# Altium project LED ring V1.PrjPcb
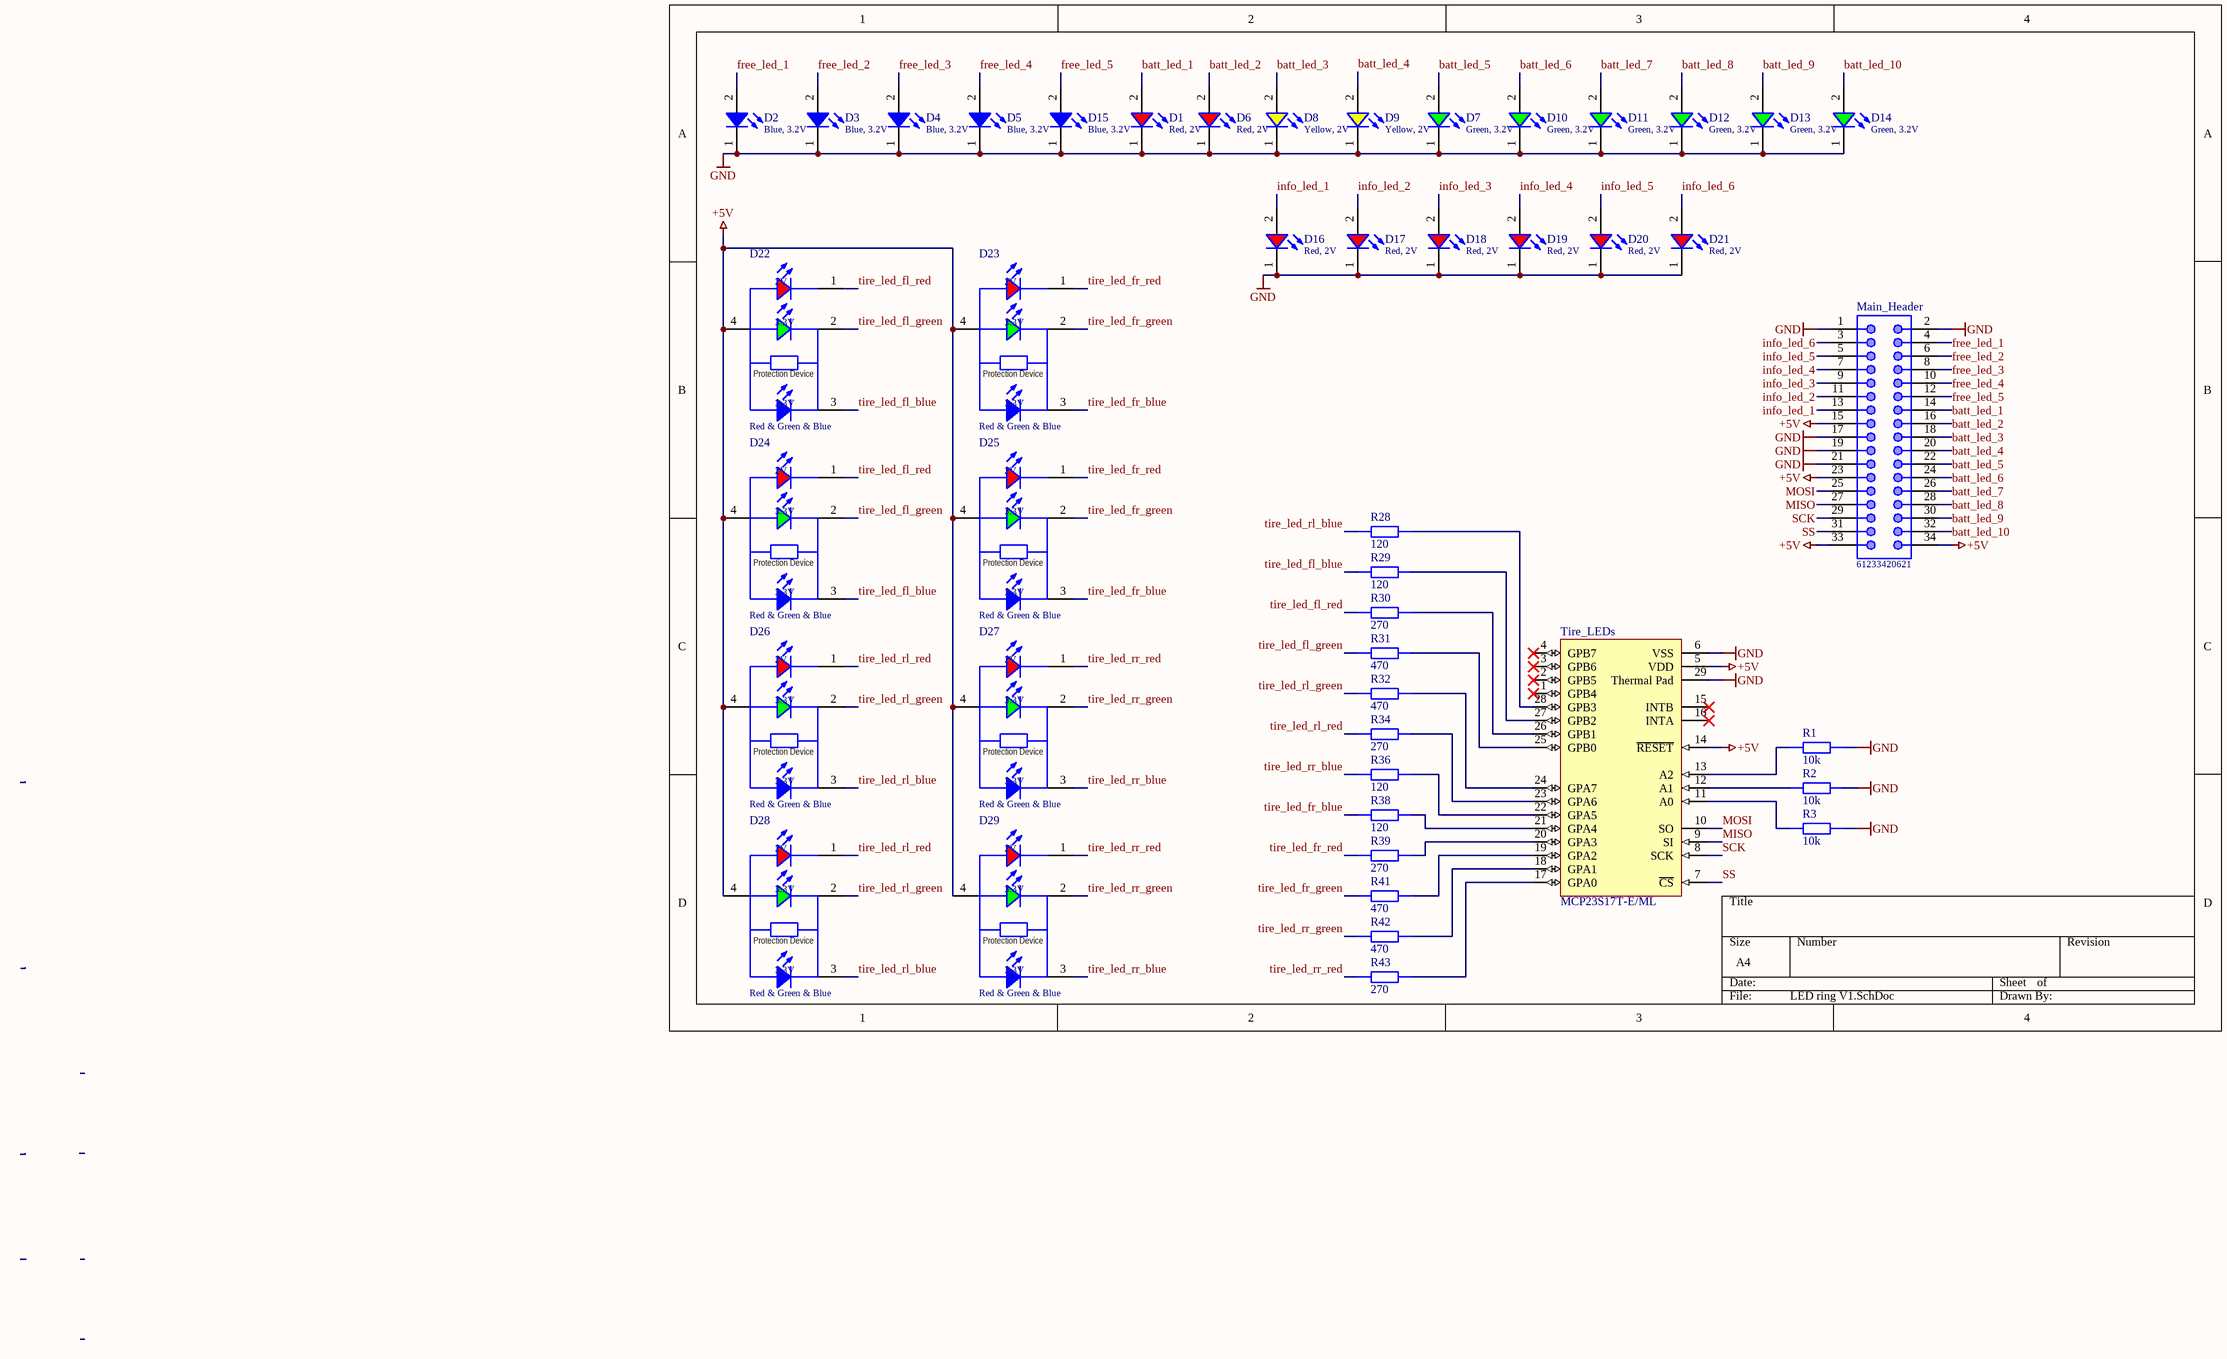
[diagram p0: LED ring V1.SchDoc]
1 sheet, 46 parts. Net scope: global (net labels, ports and power ports of the same name join across sheets).
Board file: LED ring V1.PcbDoc

## Sheet LED ring V1.SchDoc
size A4; SheetNumber: 1; SheetTotal: 1

### Parts
D1  Red, 2V  [WL-SMCW_0805]
D2  Blue, 3.2V  [WL-SMCW_0805]
D3  Blue, 3.2V  [WL-SMCW_0805]
D4  Blue, 3.2V  [WL-SMCW_0805]
D5  Blue, 3.2V  [WL-SMCW_0805]
D6  Red, 2V  [WL-SMCW_0805]
D7  Green, 3.2V  [WL-SMCW_0805]
D8  Yellow, 2V  [WL-SMCW_0805]
D9  Yellow, 2V  [WL-SMCW_0805]
D10  Green, 3.2V  [WL-SMCW_0805]
D11  Green, 3.2V  [WL-SMCW_0805]
D12  Green, 3.2V  [WL-SMCW_0805]
D13  Green, 3.2V  [WL-SMCW_0805]
D14  Green, 3.2V  [WL-SMCW_0805]
D15  Blue, 3.2V  [WL-SMCW_0805]
D16  Red, 2V  [WL-SMCW_0805]
D17  Red, 2V  [WL-SMCW_0805]
D18  Red, 2V  [WL-SMCW_0805]
D19  Red, 2V  [WL-SMCW_0805]
D20  Red, 2V  [WL-SMCW_0805]
D21  Red, 2V  [WL-SMCW_0805]
D22  Red & Green & Blue  [WL-SFCW_0805]
D23  Red & Green & Blue  [WL-SFCW_0805]
D24  Red & Green & Blue  [WL-SFCW_0805]
D25  Red & Green & Blue  [WL-SFCW_0805]
D26  Red & Green & Blue  [WL-SFCW_0805]
D27  Red & Green & Blue  [WL-SFCW_0805]
D28  Red & Green & Blue  [WL-SFCW_0805]
D29  Red & Green & Blue  [WL-SFCW_0805]
Main_Header  61233420621  [61233420621]
R1  value 10k  [STACKPOLE CSR0603]  (hidden comment: SMD Resistor)
R2  value 10k  [STACKPOLE CSR0603]  (hidden comment: SMD Resistor)
R3  value 10k  [STACKPOLE CSR0603]  (hidden comment: SMD Resistor)
R28  value 120  [STACKPOLE CSR0603]  (hidden comment: SMD Resistor)
R29  value 120  [STACKPOLE CSR0603]  (hidden comment: SMD Resistor)
R30  value 270  [STACKPOLE CSR0603]  (hidden comment: SMD Resistor)
R31  value 470  [STACKPOLE CSR0603]  (hidden comment: SMD Resistor)
R32  value 470  [STACKPOLE CSR0603]  (hidden comment: SMD Resistor)
R34  value 270  [STACKPOLE CSR0603]  (hidden comment: SMD Resistor)
R36  value 120  [STACKPOLE CSR0603]  (hidden comment: SMD Resistor)
R38  value 120  [STACKPOLE CSR0603]  (hidden comment: SMD Resistor)
R39  value 270  [STACKPOLE CSR0603]  (hidden comment: SMD Resistor)
R41  value 470  [STACKPOLE CSR0603]  (hidden comment: SMD Resistor)
R42  value 470  [STACKPOLE CSR0603]  (hidden comment: SMD Resistor)
R43  value 270  [STACKPOLE CSR0603]  (hidden comment: SMD Resistor)
Tire_LEDs  MCP23S17T-E/ML  [QFN-ML28_M]

### Nets
+5V: D22.4(A) D23.4(A) D24.4(A) D25.4(A) D26.4(A) D27.4(A) D28.4(A) D29.4(A) Main_Header.15 Main_Header.23 Main_Header.33 Main_Header.34 Tire_LEDs.5(VDD) Tire_LEDs.14(~{RESET})
GND: D1.1(K) D2.1(K) D3.1(K) D4.1(K) D5.1(K) D6.1(K) D7.1(K) D8.1(K) D9.1(K) D10.1(K) D11.1(K) D12.1(K) D13.1(K) D14.1(K) D15.1(K) D16.1(K) D17.1(K) D18.1(K) D19.1(K) D20.1(K) D21.1(K) Main_Header.1 Main_Header.2 Main_Header.17 Main_Header.19 Main_Header.21 R1.2 R2.2 R3.2 Tire_LEDs.6(VSS) Tire_LEDs.29(Thermal_Pad)
batt_led_1: D1.2(A) Main_Header.14
batt_led_2: D6.2(A) Main_Header.16
batt_led_3: D8.2(A) Main_Header.18
batt_led_4: D9.2(A) Main_Header.20
batt_led_5: D7.2(A) Main_Header.22
batt_led_6: D10.2(A) Main_Header.24
batt_led_7: D11.2(A) Main_Header.26
batt_led_8: D12.2(A) Main_Header.28
batt_led_9: D13.2(A) Main_Header.30
batt_led_10: D14.2(A) Main_Header.32
free_led_1: D2.2(A) Main_Header.4
free_led_2: D3.2(A) Main_Header.6
free_led_3: D4.2(A) Main_Header.8
free_led_4: D5.2(A) Main_Header.10
free_led_5: D15.2(A) Main_Header.12
info_led_1: D16.2(A) Main_Header.13
info_led_2: D17.2(A) Main_Header.11
info_led_3: D18.2(A) Main_Header.9
info_led_4: D19.2(A) Main_Header.7
info_led_5: D20.2(A) Main_Header.5
info_led_6: D21.2(A) Main_Header.3
MISO: Main_Header.27 Tire_LEDs.9(SI)
MOSI: Main_Header.25 Tire_LEDs.10(SO)
SCK: Main_Header.29 Tire_LEDs.8(SCK)
SS: Main_Header.31 Tire_LEDs.7(~{CS})
tire_led_fl_blue: D22.3(K) D24.3(K) R29.2
tire_led_fl_green: D22.2(K) D24.2(K) R31.2
tire_led_fl_red: D22.1(K) D24.1(K) R30.2
tire_led_fr_blue: D23.3(K) D25.3(K) R38.2
tire_led_fr_green: D23.2(K) D25.2(K) R41.2
tire_led_fr_red: D23.1(K) D25.1(K) R39.2
tire_led_rl_blue: D26.3(K) D28.3(K) R28.2
tire_led_rl_green: D26.2(K) D28.2(K) R32.2
tire_led_rl_red: D26.1(K) D28.1(K) R34.2
tire_led_rr_blue: D27.3(K) D29.3(K) R36.2
tire_led_rr_green: D27.2(K) D29.2(K) R42.2
tire_led_rr_red: D27.1(K) D29.1(K) R43.2
NetR1_1: R1.1 Tire_LEDs.13(A2)
NetR2_1: R2.1 Tire_LEDs.12(A1)
NetR3_1: R3.1 Tire_LEDs.11(A0)
NetR28_1: R28.1 Tire_LEDs.28(GPB3)
NetR29_1: R29.1 Tire_LEDs.27(GPB2)
NetR30_1: R30.1 Tire_LEDs.26(GPB1)
NetR31_1: R31.1 Tire_LEDs.25(GPB0)
NetR32_1: R32.1 Tire_LEDs.24(GPA7)
NetR34_1: R34.1 Tire_LEDs.23(GPA6)
NetR36_1: R36.1 Tire_LEDs.22(GPA5)
NetR38_1: R38.1 Tire_LEDs.21(GPA4)
NetR39_1: R39.1 Tire_LEDs.20(GPA3)
NetR41_1: R41.1 Tire_LEDs.19(GPA2)
NetR42_1: R42.1 Tire_LEDs.18(GPA1)
NetR43_1: R43.1 Tire_LEDs.17(GPA0)

Not connected (* = marked no-connect by the designer): Tire_LEDs 1(GPB4)* 2(GPB5)* 3(GPB6)* 4(GPB7)* 15(INTB)* 16(INTA)*

### Notes on the sheet
- (in symbol 150080M173000) 2V; 3.3V; Protection Device

### Library data of the parts
D1 D6 D16-D21 = 150080RS75000: WL-SMCW SMT Mono-color Chip LED Waterclear, size 0805, Red, 2V, 140deg; Chip Technology: AlInGaP; Dominant Wavelength typ.: 625nm; Luminous Intensity typ.: 150mcd; Peak Wavelength typ.: 630nm; Viewing Angle: 140deg; ComponentLink1Description: Manufacturer; ComponentLink1URL: http://www.we-online.de; ComponentLink2URL: https://www.we-online.com/catalog/datasheet/150080RS75000.pdf; ComponentLink2Description: Datasheet; Forward Voltage typ.: 2V; Emitting Color: Red; Mounting Technology: SMT; Operating Temperature: -40 to +85degC; Published Date: December 2019; Part Number: 150080RS75000; Packaging: Tape and Reel; Size: 0805; Publisher: Wurth Elektronik
D2-D5 D15 = 150080BS75000: WL-SMCW SMT Mono-color Chip LED Waterclear, size 0805, Blue, 3.2V, 140deg; Chip Technology: InGaN; Dominant Wavelength typ.: 470nm; Luminous Intensity typ.: 145mcd; Peak Wavelength typ.: 465nm; Viewing Angle: 140deg; ComponentLink1Description: Manufacturer; ComponentLink1URL: http://www.we-online.de; ComponentLink2URL: https://www.we-online.com/catalog/datasheet/150080BS75000.pdf; ComponentLink2Description: Datasheet; Forward Voltage typ.: 3.2V; Emitting Color: Blue; Mounting Technology: SMT; Operating Temperature: -40 to +85degC; Published Date: December 2019; Part Number: 150080BS75000; Packaging: Tape and Reel; Size: 0805; Publisher: Wurth Elektronik
D7 D10-D14 = 150080GS75000: WL-SMCW SMT Mono-color Chip LED Waterclear, size 0805, Green, 3.2V, 140deg; Chip Technology: InGaN; Dominant Wavelength typ.: 525nm; Luminous Intensity typ.: 450mcd; Peak Wavelength typ.: 515nm; Viewing Angle: 140deg; ComponentLink1Description: Manufacturer; ComponentLink1URL: http://www.we-online.de; ComponentLink2URL: https://www.we-online.com/catalog/datasheet/150080GS75000.pdf; ComponentLink2Description: Datasheet; Forward Voltage typ.: 3.2V; Emitting Color: Green; Mounting Technology: SMT; Operating Temperature: -40 to +85degC; Published Date: December 2019; Part Number: 150080GS75000; Packaging: Tape and Reel; Size: 0805; Publisher: Wurth Elektronik
D8 D9 = 150080YS75000: WL-SMCW SMT Mono-color Chip LED Waterclear, size 0805, Yellow, 2V, 140deg; Chip Technology: AlInGaP; Dominant Wavelength typ.: 590nm; Luminous Intensity typ.: 120mcd; Peak Wavelength typ.: 595nm; Viewing Angle: 140deg; ComponentLink1Description: Manufacturer; ComponentLink1URL: http://www.we-online.de; ComponentLink2URL: https://www.we-online.com/catalog/datasheet/150080YS75000.pdf; ComponentLink2Description: Datasheet; Forward Voltage typ.: 2V; Emitting Color: Yellow; Mounting Technology: SMT; Operating Temperature: -40 to +85degC; Published Date: December 2019; Part Number: 150080YS75000; Packaging: Tape and Reel; Size: 0805; Publisher: Wurth Elektronik
D22-D29 = 150080M173000: WL-SFCW SMT Full-color Chip LED Waterclear, size 0805, Red & Green & Blue, 120deg; Chip Technology: AlInGaP + InGaN; Dominant Wavelength typ.: Blue:470nm, Green:525nm, Red:624nm; Forward Voltage typ.: Blue:3.3V, Green:3.3V, Red:2V; Luminous Intensity typ.: Blue:70mcd, Green:285mcd, Red:112mcd; Peak Wavelength typ.: Blue:468nm, Green:520nm, Red:632nm; Viewing Angle: 120deg; ComponentLink1Description: Manufacturer; ComponentLink1URL: http://www.we-online.de; ComponentLink2URL: https://www.we-online.com/catalog/datasheet/150080M173000.pdf; ComponentLink2Description: Datasheet; Emitting Color: Red & Green & Blue; Mounting Technology: SMT; Operating Temperature: -40 to +85degC; Published Date: December 2019; Part Number: 150080M173000; Packaging: Tape and Reel; Size: 0805; Publisher: Wurth Elektronik
Main_Header = 61233420621: WR-BHD Box Header, Male PCB side, pitch 2.54mm, SMT, Straight, 34p; Manufacturer: Wurth Elektronik; Working Voltage: 250VAC; Withstanding Voltage: 500VAC; Contact Resistance: 20mOhm; Pin Number: 34; Insulation Resistance: 1000MOhm; Rated Current: 3A; System: Connector; ComponentLink1Description: Manufacturer; ComponentLink1URL: http://www.we-online.de; ComponentLink2Description: Datasheet; ComponentLink2URL: https://www.we-online.com/catalog/datasheet/61233420621.pdf; Manufacturer Part Number: 61233420621; Published Date: August 2021; Pitch: 2.54mm; Operating Temperature: -40 to +125degC; Packaging: Tape and Reel with Cap; Gender: Male PCB side; Mounting Technology: SMT; Type: Straight; Length: 50.98mm
R1-R3 R28-R32 R34 R36 R38 R39 R41-R43 = SMD Resistor: Resistor with multiple footprints
Tire_LEDs = CMP-0186-00026-2: 16-Bit I/O Expander with Serial Interface, 28-Pin QFN, Extended Temperature, Tape and Reel; PackageReference: QFN-ML28; RevisionNote: URLs added. Sch pin type corrected.; DatasheetVersion: revB, Feb-2007; ComponentLink1Description: Manufacturer URL; ComponentLink3URL: http://www.microchip.com/stellent/groups/techpub_sg/documents/packagingspec/en012702.pdf; PackageDescription: 28-Lead Plastic Quad Flat, No Lead Package (ML) - 6x6 mm Body [QFN] with 0.55 mm Contact Length; Code_JEDEC: MO-220; ComponentLink2Description: Datasheet; ComponentLink1URL: http://www.microchip.com/; ComponentLink2URL: http://ww1.microchip.com/downloads/en/DeviceDoc/21952a.pdf; PackageVersion: revBB, Aug-2009; ComponentLink3Description: Package Specification